# Altium schematic sheet EntradaSensorTemperatura.SchDoc: CONTROLADORA AIRPOPCORN
size A3; DocumentNumber: 9; SheetNumber: 9; SheetTotal: 15
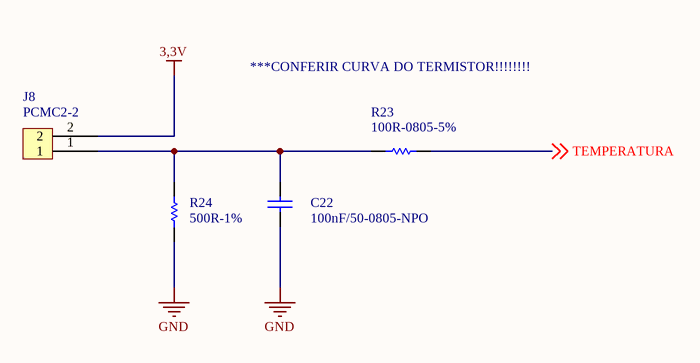
[diagram p0: EntradaSensorTemperatura.SchDoc]

## Parts
C22  100nF/50-0805-NPO  [0805-REVISADO ONDA]
J8  PCMC2-2  [PCMC2-2]
R23  100R-0805-5%  [0805-REVISADO ONDA]
R24  500R-1%  [0805-REVISADO ONDA]

## Nets
3,3V: J8.2
GND: C22.1 R24.1
TEMPERATURA: R23.2 ; off-sheet TEMPERATURA
NetC22_2: C22.2 J8.1 R23.1 R24.2

## Notes on the sheet
- ***CONFERIR CURVA DO TERMISTOR!!!!!!!!
- NOME
- DATA
- PROJETO
- DESCRIÇÃO
- desenho
- verif.
- aprov.
- TAMANHO
- CODIGO
- Todas as informações disponíveis
- não devem ser divulgadas,
- em parte ou todo.
- CIRCUITO IMPRESSO
- MONTAGEM ELETRÔNICA
- A4
- de

## Library data of the parts
R24 = 10K-0805-5%: ERP: 102.11.054
C22 = 100nF/50-0805-NPO: ERP: 104.11.005
R23 = 100R-0805-5%: ERP: 102.11.031